# Altium project TB_Controller.PrjPcb
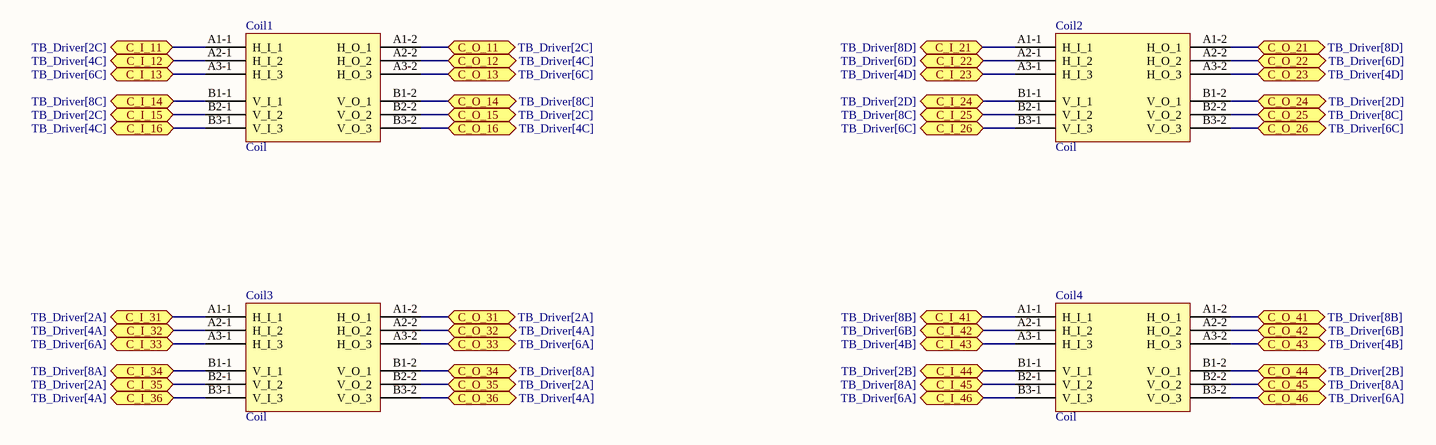
[diagram p0: TB_Piste.SchDoc]
3 sheets, 52 parts. Net scope: flat (ports and power ports of the same name join across sheets).
Board file: TB_PCB.PcbDoc
Sheets:
  TB_Piste.SchDoc
  TB_Driver.SchDoc
  TB_Controller.SchDoc

## Sheet TB_Piste.SchDoc
size A3; SheetNumber: 1; SheetTotal: 3

### Parts
Coil1  Coil  [Bidirectional_Coil]
Coil2  Coil  [Bidirectional_Coil]
Coil3  Coil  [Bidirectional_Coil]
Coil4  Coil  [Bidirectional_Coil]

### Ports
C_I_11 (bidir, see TB_Driver[2C]), C_I_12 (bidir, see TB_Driver[4C]), C_I_13 (bidir, see TB_Driver[6C]), C_I_14 (bidir, see TB_Driver[8C]), C_I_15 (bidir, see TB_Driver[2C]), C_I_16 (bidir, see TB_Driver[4C]), C_I_21 (bidir, see TB_Driver[8D]), C_I_22 (bidir, see TB_Driver[6D]), C_I_23 (bidir, see TB_Driver[4D]), C_I_24 (bidir, see TB_Driver[2D]), C_I_25 (bidir, see TB_Driver[8C]), C_I_26 (bidir, see TB_Driver[6C]), C_I_31 (bidir, see TB_Driver[2A]), C_I_32 (bidir, see TB_Driver[4A]), C_I_33 (bidir, see TB_Driver[6A]), C_I_34 (bidir, see TB_Driver[8A]), C_I_35 (bidir, see TB_Driver[2A]), C_I_36 (bidir, see TB_Driver[4A]), C_I_41 (bidir, see TB_Driver[8B]), C_I_42 (bidir, see TB_Driver[6B]), C_I_43 (bidir, see TB_Driver[4B]), C_I_44 (bidir, see TB_Driver[2B]), C_I_45 (bidir, see TB_Driver[8A]), C_I_46 (bidir, see TB_Driver[6A]), C_O_11 (bidir, see TB_Driver[2C]), C_O_12 (bidir, see TB_Driver[4C]), C_O_13 (bidir, see TB_Driver[6C]), C_O_14 (bidir, see TB_Driver[8C]), C_O_15 (bidir, see TB_Driver[2C]), C_O_16 (bidir, see TB_Driver[4C]), C_O_21 (bidir, see TB_Driver[8D]), C_O_22 (bidir, see TB_Driver[6D]), C_O_23 (bidir, see TB_Driver[4D]), C_O_24 (bidir, see TB_Driver[2D]), C_O_25 (bidir, see TB_Driver[8C]), C_O_26 (bidir, see TB_Driver[6C]), C_O_31 (bidir, see TB_Driver[2A]), C_O_32 (bidir, see TB_Driver[4A]), C_O_33 (bidir, see TB_Driver[6A]), C_O_34 (bidir, see TB_Driver[8A]), C_O_35 (bidir, see TB_Driver[2A]), C_O_36 (bidir, see TB_Driver[4A]), C_O_41 (bidir, see TB_Driver[8B]), C_O_42 (bidir, see TB_Driver[6B]), C_O_43 (bidir, see TB_Driver[4B]), C_O_44 (bidir, see TB_Driver[2B]), C_O_45 (bidir, see TB_Driver[8A]), C_O_46 (bidir, see TB_Driver[6A])

### Nets
NetCoil1_A1-1: Coil1.A1-1(H_I_1) ; port C_I_11
NetCoil1_A1-2: Coil1.A1-2(H_O_1) ; port C_O_11
NetCoil1_A2-1: Coil1.A2-1(H_I_2) ; port C_I_12
NetCoil1_A2-2: Coil1.A2-2(H_O_2) ; port C_O_12
NetCoil1_A3-1: Coil1.A3-1(H_I_3) ; port C_I_13
NetCoil1_A3-2: Coil1.A3-2(H_O_3) ; port C_O_13
NetCoil1_B1-1: Coil1.B1-1(V_I_1) ; port C_I_14
NetCoil1_B1-2: Coil1.B1-2(V_O_1) ; port C_O_14
NetCoil1_B2-1: Coil1.B2-1(V_I_2) ; port C_I_15
NetCoil1_B2-2: Coil1.B2-2(V_O_2) ; port C_O_15
NetCoil1_B3-1: Coil1.B3-1(V_I_3) ; port C_I_16
NetCoil1_B3-2: Coil1.B3-2(V_O_3) ; port C_O_16
NetCoil2_A1-1: Coil2.A1-1(H_I_1) ; port C_I_21
NetCoil2_A1-2: Coil2.A1-2(H_O_1) ; port C_O_21
NetCoil2_A2-1: Coil2.A2-1(H_I_2) ; port C_I_22
NetCoil2_A2-2: Coil2.A2-2(H_O_2) ; port C_O_22
NetCoil2_A3-1: Coil2.A3-1(H_I_3) ; port C_I_23
NetCoil2_A3-2: Coil2.A3-2(H_O_3) ; port C_O_23
NetCoil2_B1-1: Coil2.B1-1(V_I_1) ; port C_I_24
NetCoil2_B1-2: Coil2.B1-2(V_O_1) ; port C_O_24
NetCoil2_B2-1: Coil2.B2-1(V_I_2) ; port C_I_25
NetCoil2_B2-2: Coil2.B2-2(V_O_2) ; port C_O_25
NetCoil2_B3-1: Coil2.B3-1(V_I_3) ; port C_I_26
NetCoil2_B3-2: Coil2.B3-2(V_O_3) ; port C_O_26
NetCoil3_A1-1: Coil3.A1-1(H_I_1) ; port C_I_31
NetCoil3_A1-2: Coil3.A1-2(H_O_1) ; port C_O_31
NetCoil3_A2-1: Coil3.A2-1(H_I_2) ; port C_I_32
NetCoil3_A2-2: Coil3.A2-2(H_O_2) ; port C_O_32
NetCoil3_A3-1: Coil3.A3-1(H_I_3) ; port C_I_33
NetCoil3_A3-2: Coil3.A3-2(H_O_3) ; port C_O_33
NetCoil3_B1-1: Coil3.B1-1(V_I_1) ; port C_I_34
NetCoil3_B1-2: Coil3.B1-2(V_O_1) ; port C_O_34
NetCoil3_B2-1: Coil3.B2-1(V_I_2) ; port C_I_35
NetCoil3_B2-2: Coil3.B2-2(V_O_2) ; port C_O_35
NetCoil3_B3-1: Coil3.B3-1(V_I_3) ; port C_I_36
NetCoil3_B3-2: Coil3.B3-2(V_O_3) ; port C_O_36
NetCoil4_A1-1: Coil4.A1-1(H_I_1) ; port C_I_41
NetCoil4_A1-2: Coil4.A1-2(H_O_1) ; port C_O_41
NetCoil4_A2-1: Coil4.A2-1(H_I_2) ; port C_I_42
NetCoil4_A2-2: Coil4.A2-2(H_O_2) ; port C_O_42
NetCoil4_A3-1: Coil4.A3-1(H_I_3) ; port C_I_43
NetCoil4_A3-2: Coil4.A3-2(H_O_3) ; port C_O_43
NetCoil4_B1-1: Coil4.B1-1(V_I_1) ; port C_I_44
NetCoil4_B1-2: Coil4.B1-2(V_O_1) ; port C_O_44
NetCoil4_B2-1: Coil4.B2-1(V_I_2) ; port C_I_45
NetCoil4_B2-2: Coil4.B2-2(V_O_2) ; port C_O_45
NetCoil4_B3-1: Coil4.B3-1(V_I_3) ; port C_I_46
NetCoil4_B3-2: Coil4.B3-2(V_O_3) ; port C_O_46

## Sheet TB_Driver.SchDoc
size A3; SheetNumber: 2; SheetTotal: 3
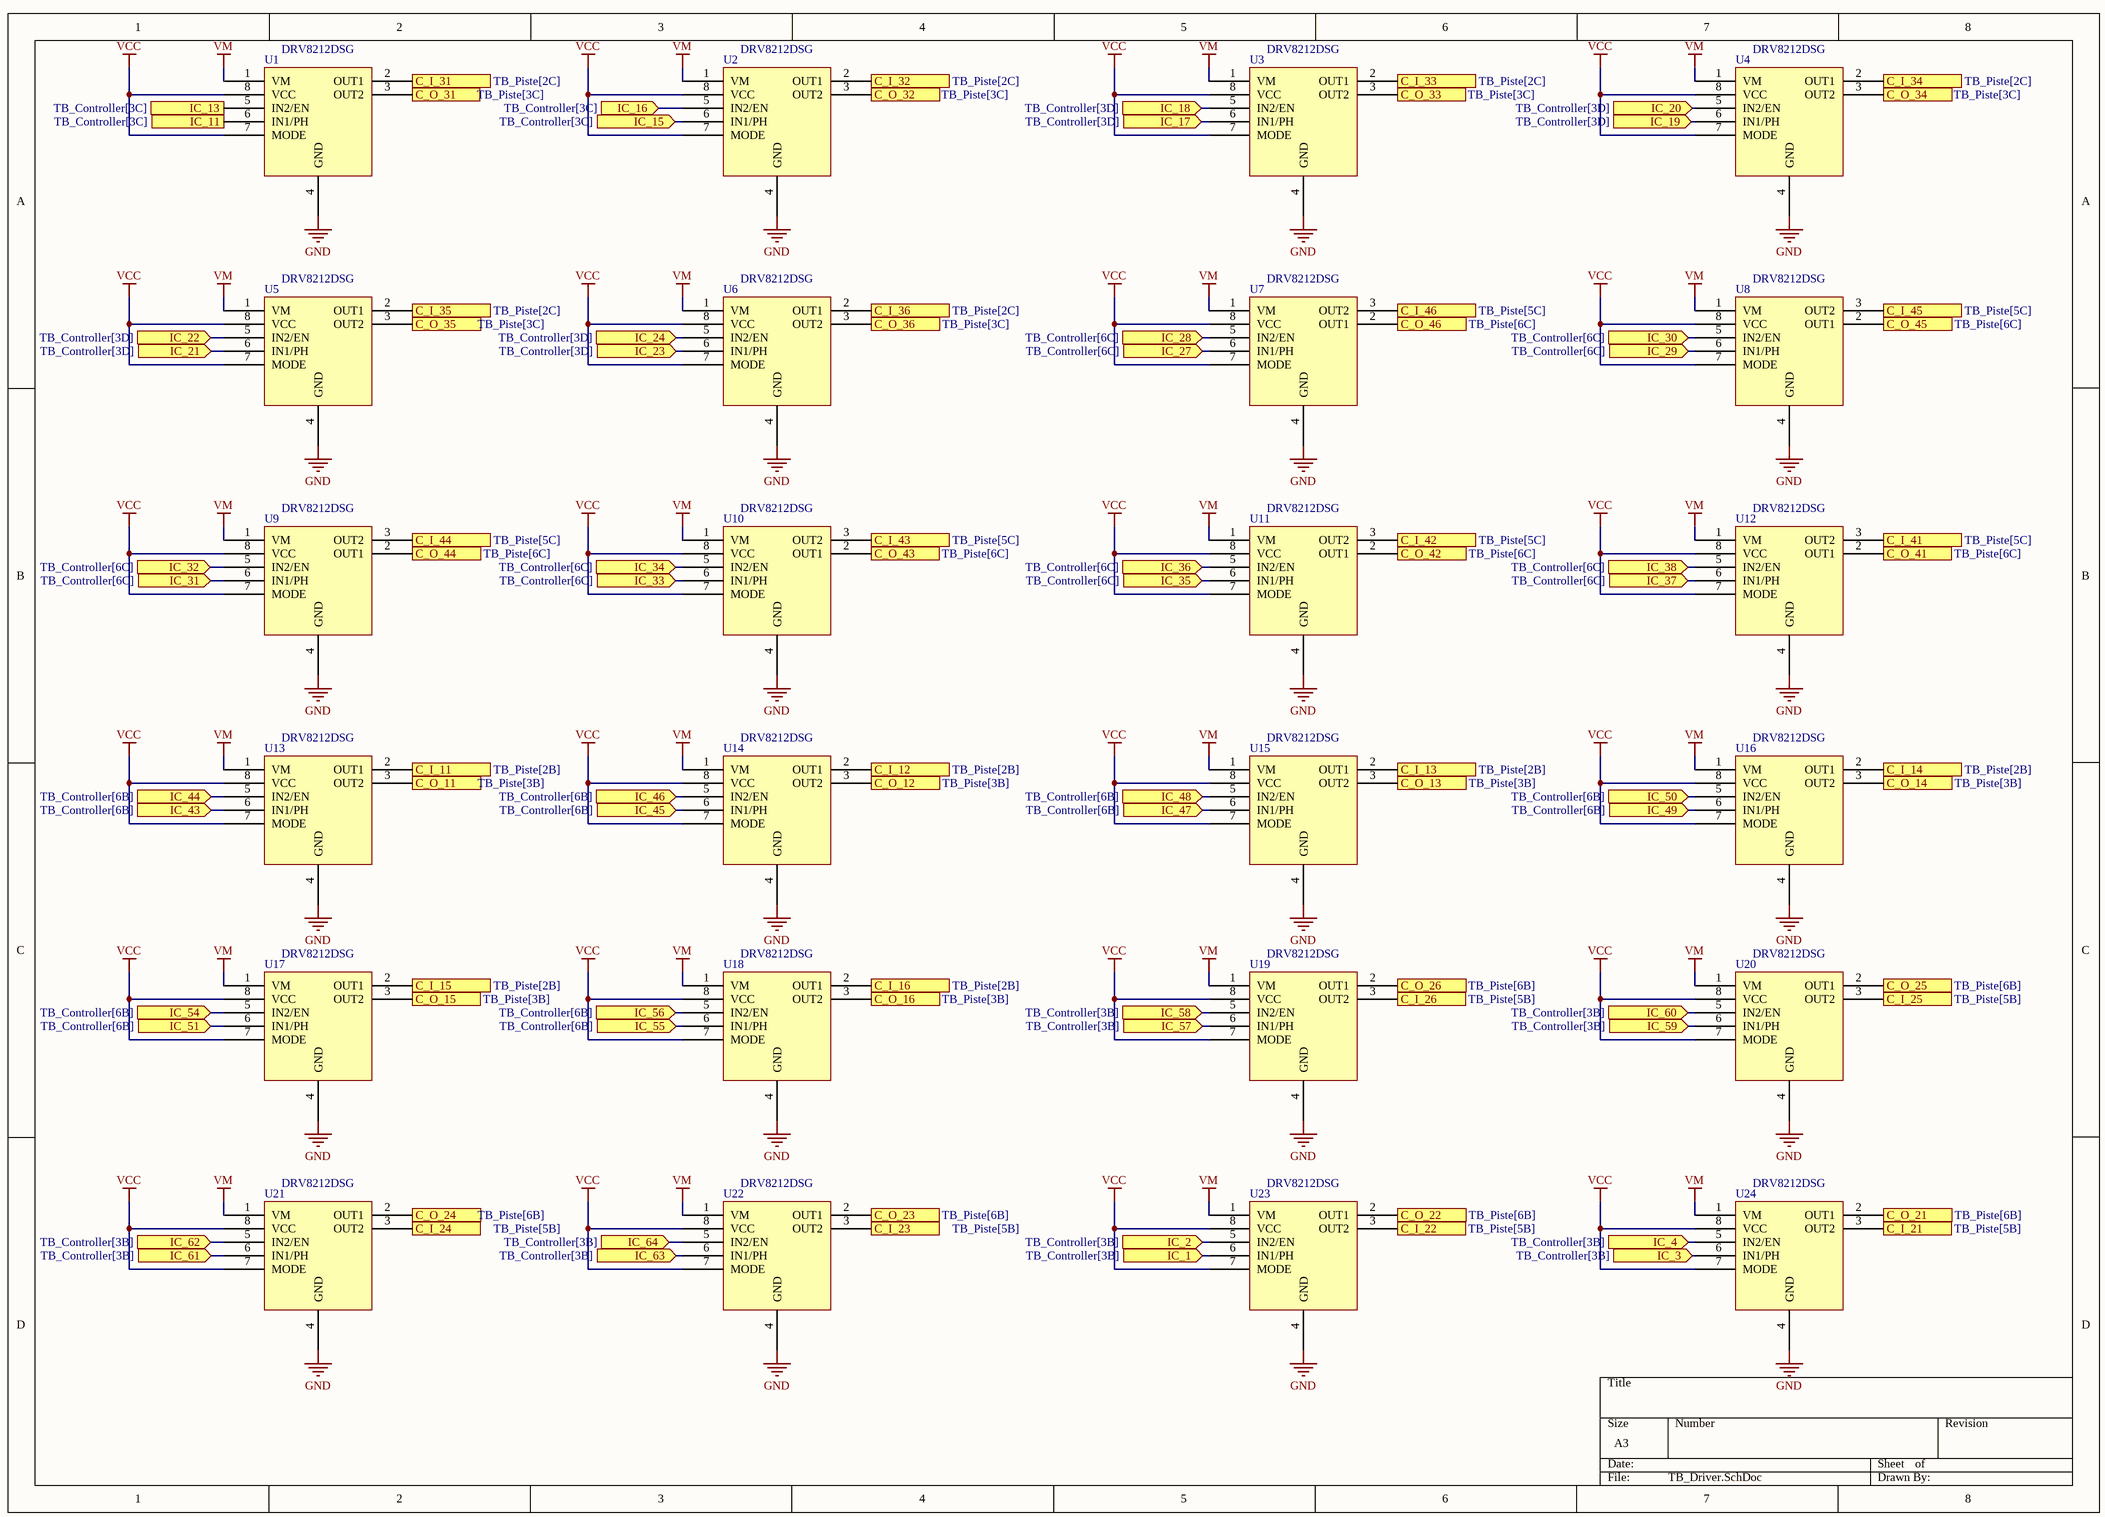
[diagram p1: TB_Driver.SchDoc]

### Parts
U1  DRV8212DSG  [DRV8212DSGR]
U2  DRV8212DSG  [DRV8212DSGR]
U3  DRV8212DSG  [DRV8212DSGR]
U4  DRV8212DSG  [DRV8212DSGR]
U5  DRV8212DSG  [DRV8212DSGR]
U6  DRV8212DSG  [DRV8212DSGR]
U7  DRV8212DSG  [DRV8212DSGR]
U8  DRV8212DSG  [DRV8212DSGR]
U9  DRV8212DSG  [DRV8212DSGR]
U10  DRV8212DSG  [DRV8212DSGR]
U11  DRV8212DSG  [DRV8212DSGR]
U12  DRV8212DSG  [DRV8212DSGR]
U13  DRV8212DSG  [DRV8212DSGR]
U14  DRV8212DSG  [DRV8212DSGR]
U15  DRV8212DSG  [DRV8212DSGR]
U16  DRV8212DSG  [DRV8212DSGR]
U17  DRV8212DSG  [DRV8212DSGR]
U18  DRV8212DSG  [DRV8212DSGR]
U19  DRV8212DSG  [DRV8212DSGR]
U20  DRV8212DSG  [DRV8212DSGR]
U21  DRV8212DSG  [DRV8212DSGR]
U22  DRV8212DSG  [DRV8212DSGR]
U23  DRV8212DSG  [DRV8212DSGR]
U24  DRV8212DSG  [DRV8212DSGR]

### Ports
C_I_11 (see TB_Piste[2B]), C_I_12 (see TB_Piste[2B]), C_I_13 (see TB_Piste[2B]), C_I_14 (see TB_Piste[2B]), C_I_15 (see TB_Piste[2B]), C_I_16 (see TB_Piste[2B]), C_I_21 (see TB_Piste[5B]), C_I_22 (see TB_Piste[5B]), C_I_23 (see TB_Piste[5B]), C_I_24 (see TB_Piste[5B]), C_I_25 (see TB_Piste[5B]), C_I_26 (see TB_Piste[5B]), C_I_31 (see TB_Piste[2C]), C_I_32 (see TB_Piste[2C]), C_I_33 (see TB_Piste[2C]), C_I_34 (see TB_Piste[2C]), C_I_35 (see TB_Piste[2C]), C_I_36 (see TB_Piste[2C]), C_I_41 (see TB_Piste[5C]), C_I_42 (see TB_Piste[5C]), C_I_43 (see TB_Piste[5C]), C_I_44 (see TB_Piste[5C]), C_I_45 (see TB_Piste[5C]), C_I_46 (see TB_Piste[5C]), C_O_11 (see TB_Piste[3B]), C_O_12 (see TB_Piste[3B]), C_O_13 (see TB_Piste[3B]), C_O_14 (see TB_Piste[3B]), C_O_15 (see TB_Piste[3B]), C_O_16 (see TB_Piste[3B]), C_O_21 (see TB_Piste[6B]), C_O_22 (see TB_Piste[6B]), C_O_23 (see TB_Piste[6B]), C_O_24 (see TB_Piste[6B]), C_O_25 (see TB_Piste[6B]), C_O_26 (see TB_Piste[6B]), C_O_31 (see TB_Piste[3C]), C_O_32 (see TB_Piste[3C]), C_O_33 (see TB_Piste[3C]), C_O_34 (see TB_Piste[3C]), C_O_35 (see TB_Piste[3C]), C_O_36 (see TB_Piste[3C]), C_O_41 (see TB_Piste[6C]), C_O_42 (see TB_Piste[6C]), C_O_43 (see TB_Piste[6C]), C_O_44 (see TB_Piste[6C]), C_O_45 (see TB_Piste[6C]), C_O_46 (see TB_Piste[6C]), IC_1 (in, see TB_Controller[3B]), IC_2 (in, see TB_Controller[3B]), IC_3 (in, see TB_Controller[3B]), IC_4 (in, see TB_Controller[3B]), IC_11 (in, see TB_Controller[3C]), IC_13 (in, see TB_Controller[3C]), IC_15 (in, see TB_Controller[3C]), IC_16 (in, see TB_Controller[3C]), IC_17 (in, see TB_Controller[3D]), IC_18 (in, see TB_Controller[3D]), IC_19 (in, see TB_Controller[3D]), IC_20 (in, see TB_Controller[3D]), IC_21 (in, see TB_Controller[3D]), IC_22 (in, see TB_Controller[3D]), IC_23 (in, see TB_Controller[3D]), IC_24 (in, see TB_Controller[3D]), IC_27 (in, see TB_Controller[6C]), IC_28 (in, see TB_Controller[6C]), IC_29 (in, see TB_Controller[6C]), IC_30 (in, see TB_Controller[6C]), IC_31 (in, see TB_Controller[6C]), IC_32 (in, see TB_Controller[6C]), IC_33 (in, see TB_Controller[6C]), IC_34 (in, see TB_Controller[6C]), IC_35 (in, see TB_Controller[6C]), IC_36 (in, see TB_Controller[6C]), IC_37 (in, see TB_Controller[6C]), IC_38 (in, see TB_Controller[6C]), IC_43 (in, see TB_Controller[6B]), IC_44 (in, see TB_Controller[6B]), IC_45 (in, see TB_Controller[6B]), IC_46 (in, see TB_Controller[6B]), IC_47 (in, see TB_Controller[6B]), IC_48 (in, see TB_Controller[6B]), IC_49 (in, see TB_Controller[6B]), IC_50 (in, see TB_Controller[6B]), IC_51 (in, see TB_Controller[6B]), IC_54 (in, see TB_Controller[6B]), IC_55 (in, see TB_Controller[6B]), IC_56 (in, see TB_Controller[6B]), IC_57 (in, see TB_Controller[3B]), IC_58 (in, see TB_Controller[3B]), IC_59 (in, see TB_Controller[3B]), IC_60 (in, see TB_Controller[3B]), IC_61 (in, see TB_Controller[3B]), IC_62 (in, see TB_Controller[3B]), IC_63 (in, see TB_Controller[3B]), IC_64 (in, see TB_Controller[3B])

### Nets
GND: U1.4(GND) U2.4(GND) U3.4(GND) U4.4(GND) U5.4(GND) U6.4(GND) U7.4(GND) U8.4(GND) U9.4(GND) U10.4(GND) U11.4(GND) U12.4(GND) U13.4(GND) U14.4(GND) U15.4(GND) U16.4(GND) U17.4(GND) U18.4(GND) U19.4(GND) U20.4(GND) U21.4(GND) U22.4(GND) U23.4(GND) U24.4(GND)
VCC: U1.7(MODE) U1.8(VCC) U2.7(MODE) U2.8(VCC) U3.7(MODE) U3.8(VCC) U4.7(MODE) U4.8(VCC) U5.7(MODE) U5.8(VCC) U6.7(MODE) U6.8(VCC) U7.7(MODE) U7.8(VCC) U8.7(MODE) U8.8(VCC) U9.7(MODE) U9.8(VCC) U10.7(MODE) U10.8(VCC) U11.7(MODE) U11.8(VCC) U12.7(MODE) U12.8(VCC) U13.7(MODE) U13.8(VCC) U14.7(MODE) U14.8(VCC) U15.7(MODE) U15.8(VCC) U16.7(MODE) U16.8(VCC) U17.7(MODE) U17.8(VCC) U18.7(MODE) U18.8(VCC) U19.7(MODE) U19.8(VCC) U20.7(MODE) U20.8(VCC) U21.7(MODE) U21.8(VCC) U22.7(MODE) U22.8(VCC) U23.7(MODE) U23.8(VCC) U24.7(MODE) U24.8(VCC)
VM: U1.1(VM) U2.1(VM) U3.1(VM) U4.1(VM) U5.1(VM) U6.1(VM) U7.1(VM) U8.1(VM) U9.1(VM) U10.1(VM) U11.1(VM) U12.1(VM) U13.1(VM) U14.1(VM) U15.1(VM) U16.1(VM) U17.1(VM) U18.1(VM) U19.1(VM) U20.1(VM) U21.1(VM) U22.1(VM) U23.1(VM) U24.1(VM)
NetCoil1_A1-1: U13.2(OUT1) ; port C_I_11
NetCoil1_A1-2: U13.3(OUT2) ; port C_O_11
NetCoil1_A2-1: U14.2(OUT1) ; port C_I_12
NetCoil1_A2-2: U14.3(OUT2) ; port C_O_12
NetCoil1_A3-1: U15.2(OUT1) ; port C_I_13
NetCoil1_A3-2: U15.3(OUT2) ; port C_O_13
NetCoil1_B1-1: U16.2(OUT1) ; port C_I_14
NetCoil1_B1-2: U16.3(OUT2) ; port C_O_14
NetCoil1_B2-1: U17.2(OUT1) ; port C_I_15
NetCoil1_B2-2: U17.3(OUT2) ; port C_O_15
NetCoil1_B3-1: U18.2(OUT1) ; port C_I_16
NetCoil1_B3-2: U18.3(OUT2) ; port C_O_16
NetCoil2_A1-1: U24.3(OUT2) ; port C_I_21
NetCoil2_A1-2: U24.2(OUT1) ; port C_O_21
NetCoil2_A2-1: U23.3(OUT2) ; port C_I_22
NetCoil2_A2-2: U23.2(OUT1) ; port C_O_22
NetCoil2_A3-1: U22.3(OUT2) ; port C_I_23
NetCoil2_A3-2: U22.2(OUT1) ; port C_O_23
NetCoil2_B1-1: U21.3(OUT2) ; port C_I_24
NetCoil2_B1-2: U21.2(OUT1) ; port C_O_24
NetCoil2_B2-1: U20.3(OUT2) ; port C_I_25
NetCoil2_B2-2: U20.2(OUT1) ; port C_O_25
NetCoil2_B3-1: U19.3(OUT2) ; port C_I_26
NetCoil2_B3-2: U19.2(OUT1) ; port C_O_26
NetCoil3_A1-1: U1.2(OUT1) ; port C_I_31
NetCoil3_A1-2: U1.3(OUT2) ; port C_O_31
NetCoil3_A2-1: U2.2(OUT1) ; port C_I_32
NetCoil3_A2-2: U2.3(OUT2) ; port C_O_32
NetCoil3_A3-1: U3.2(OUT1) ; port C_I_33
NetCoil3_A3-2: U3.3(OUT2) ; port C_O_33
NetCoil3_B1-1: U4.2(OUT1) ; port C_I_34
NetCoil3_B1-2: U4.3(OUT2) ; port C_O_34
NetCoil3_B2-1: U5.2(OUT1) ; port C_I_35
NetCoil3_B2-2: U5.3(OUT2) ; port C_O_35
NetCoil3_B3-1: U6.2(OUT1) ; port C_I_36
NetCoil3_B3-2: U6.3(OUT2) ; port C_O_36
NetCoil4_A1-1: U12.3(OUT2) ; port C_I_41
NetCoil4_A1-2: U12.2(OUT1) ; port C_O_41
NetCoil4_A2-1: U11.3(OUT2) ; port C_I_42
NetCoil4_A2-2: U11.2(OUT1) ; port C_O_42
NetCoil4_A3-1: U10.3(OUT2) ; port C_I_43
NetCoil4_A3-2: U10.2(OUT1) ; port C_O_43
NetCoil4_B1-1: U9.3(OUT2) ; port C_I_44
NetCoil4_B1-2: U9.2(OUT1) ; port C_O_44
NetCoil4_B2-1: U8.3(OUT2) ; port C_I_45
NetCoil4_B2-2: U8.2(OUT1) ; port C_O_45
NetCoil4_B3-1: U7.3(OUT2) ; port C_I_46
NetCoil4_B3-2: U7.2(OUT1) ; port C_O_46
NetIC1_1: U23.6(IN1/PH) ; port IC_1
NetIC1_2: U23.5(IN2/EN) ; port IC_2
NetIC1_3: U24.6(IN1/PH) ; port IC_3
NetIC1_4: U24.5(IN2/EN) ; port IC_4
NetIC1_11: U1.6(IN1/PH) ; port IC_11
NetIC1_13: U1.5(IN2/EN) ; port IC_13
NetIC1_15: U2.6(IN1/PH) ; port IC_15
NetIC1_16: U2.5(IN2/EN) ; port IC_16
NetIC1_17: U3.6(IN1/PH) ; port IC_17
NetIC1_18: U3.5(IN2/EN) ; port IC_18
NetIC1_19: U4.6(IN1/PH) ; port IC_19
NetIC1_20: U4.5(IN2/EN) ; port IC_20
NetIC1_21: U5.6(IN1/PH) ; port IC_21
NetIC1_22: U5.5(IN2/EN) ; port IC_22
NetIC1_23: U6.6(IN1/PH) ; port IC_23
NetIC1_24: U6.5(IN2/EN) ; port IC_24
NetIC1_27: U7.6(IN1/PH) ; port IC_27
NetIC1_28: U7.5(IN2/EN) ; port IC_28
NetIC1_29: U8.6(IN1/PH) ; port IC_29
NetIC1_30: U8.5(IN2/EN) ; port IC_30
NetIC1_31: U9.6(IN1/PH) ; port IC_31
NetIC1_32: U9.5(IN2/EN) ; port IC_32
NetIC1_33: U10.6(IN1/PH) ; port IC_33
NetIC1_34: U10.5(IN2/EN) ; port IC_34
NetIC1_35: U11.6(IN1/PH) ; port IC_35
NetIC1_36: U11.5(IN2/EN) ; port IC_36
NetIC1_37: U12.6(IN1/PH) ; port IC_37
NetIC1_38: U12.5(IN2/EN) ; port IC_38
NetIC1_43: U13.6(IN1/PH) ; port IC_43
NetIC1_44: U13.5(IN2/EN) ; port IC_44
NetIC1_45: U14.6(IN1/PH) ; port IC_45
NetIC1_46: U14.5(IN2/EN) ; port IC_46
NetIC1_47: U15.6(IN1/PH) ; port IC_47
NetIC1_48: U15.5(IN2/EN) ; port IC_48
NetIC1_49: U16.6(IN1/PH) ; port IC_49
NetIC1_50: U16.5(IN2/EN) ; port IC_50
NetIC1_51: U17.6(IN1/PH) ; port IC_51
NetIC1_54: U17.5(IN2/EN) ; port IC_54
NetIC1_55: U18.6(IN1/PH) ; port IC_55
NetIC1_56: U18.5(IN2/EN) ; port IC_56
NetIC1_57: U19.6(IN1/PH) ; port IC_57
NetIC1_58: U19.5(IN2/EN) ; port IC_58
NetIC1_59: U20.6(IN1/PH) ; port IC_59
NetIC1_60: U20.5(IN2/EN) ; port IC_60
NetIC1_61: U21.6(IN1/PH) ; port IC_61
NetIC1_62: U21.5(IN2/EN) ; port IC_62
NetIC1_63: U22.6(IN1/PH) ; port IC_63
NetIC1_64: U22.5(IN2/EN) ; port IC_64

## Sheet TB_Controller.SchDoc
size A3; SheetNumber: 3; SheetTotal: 3
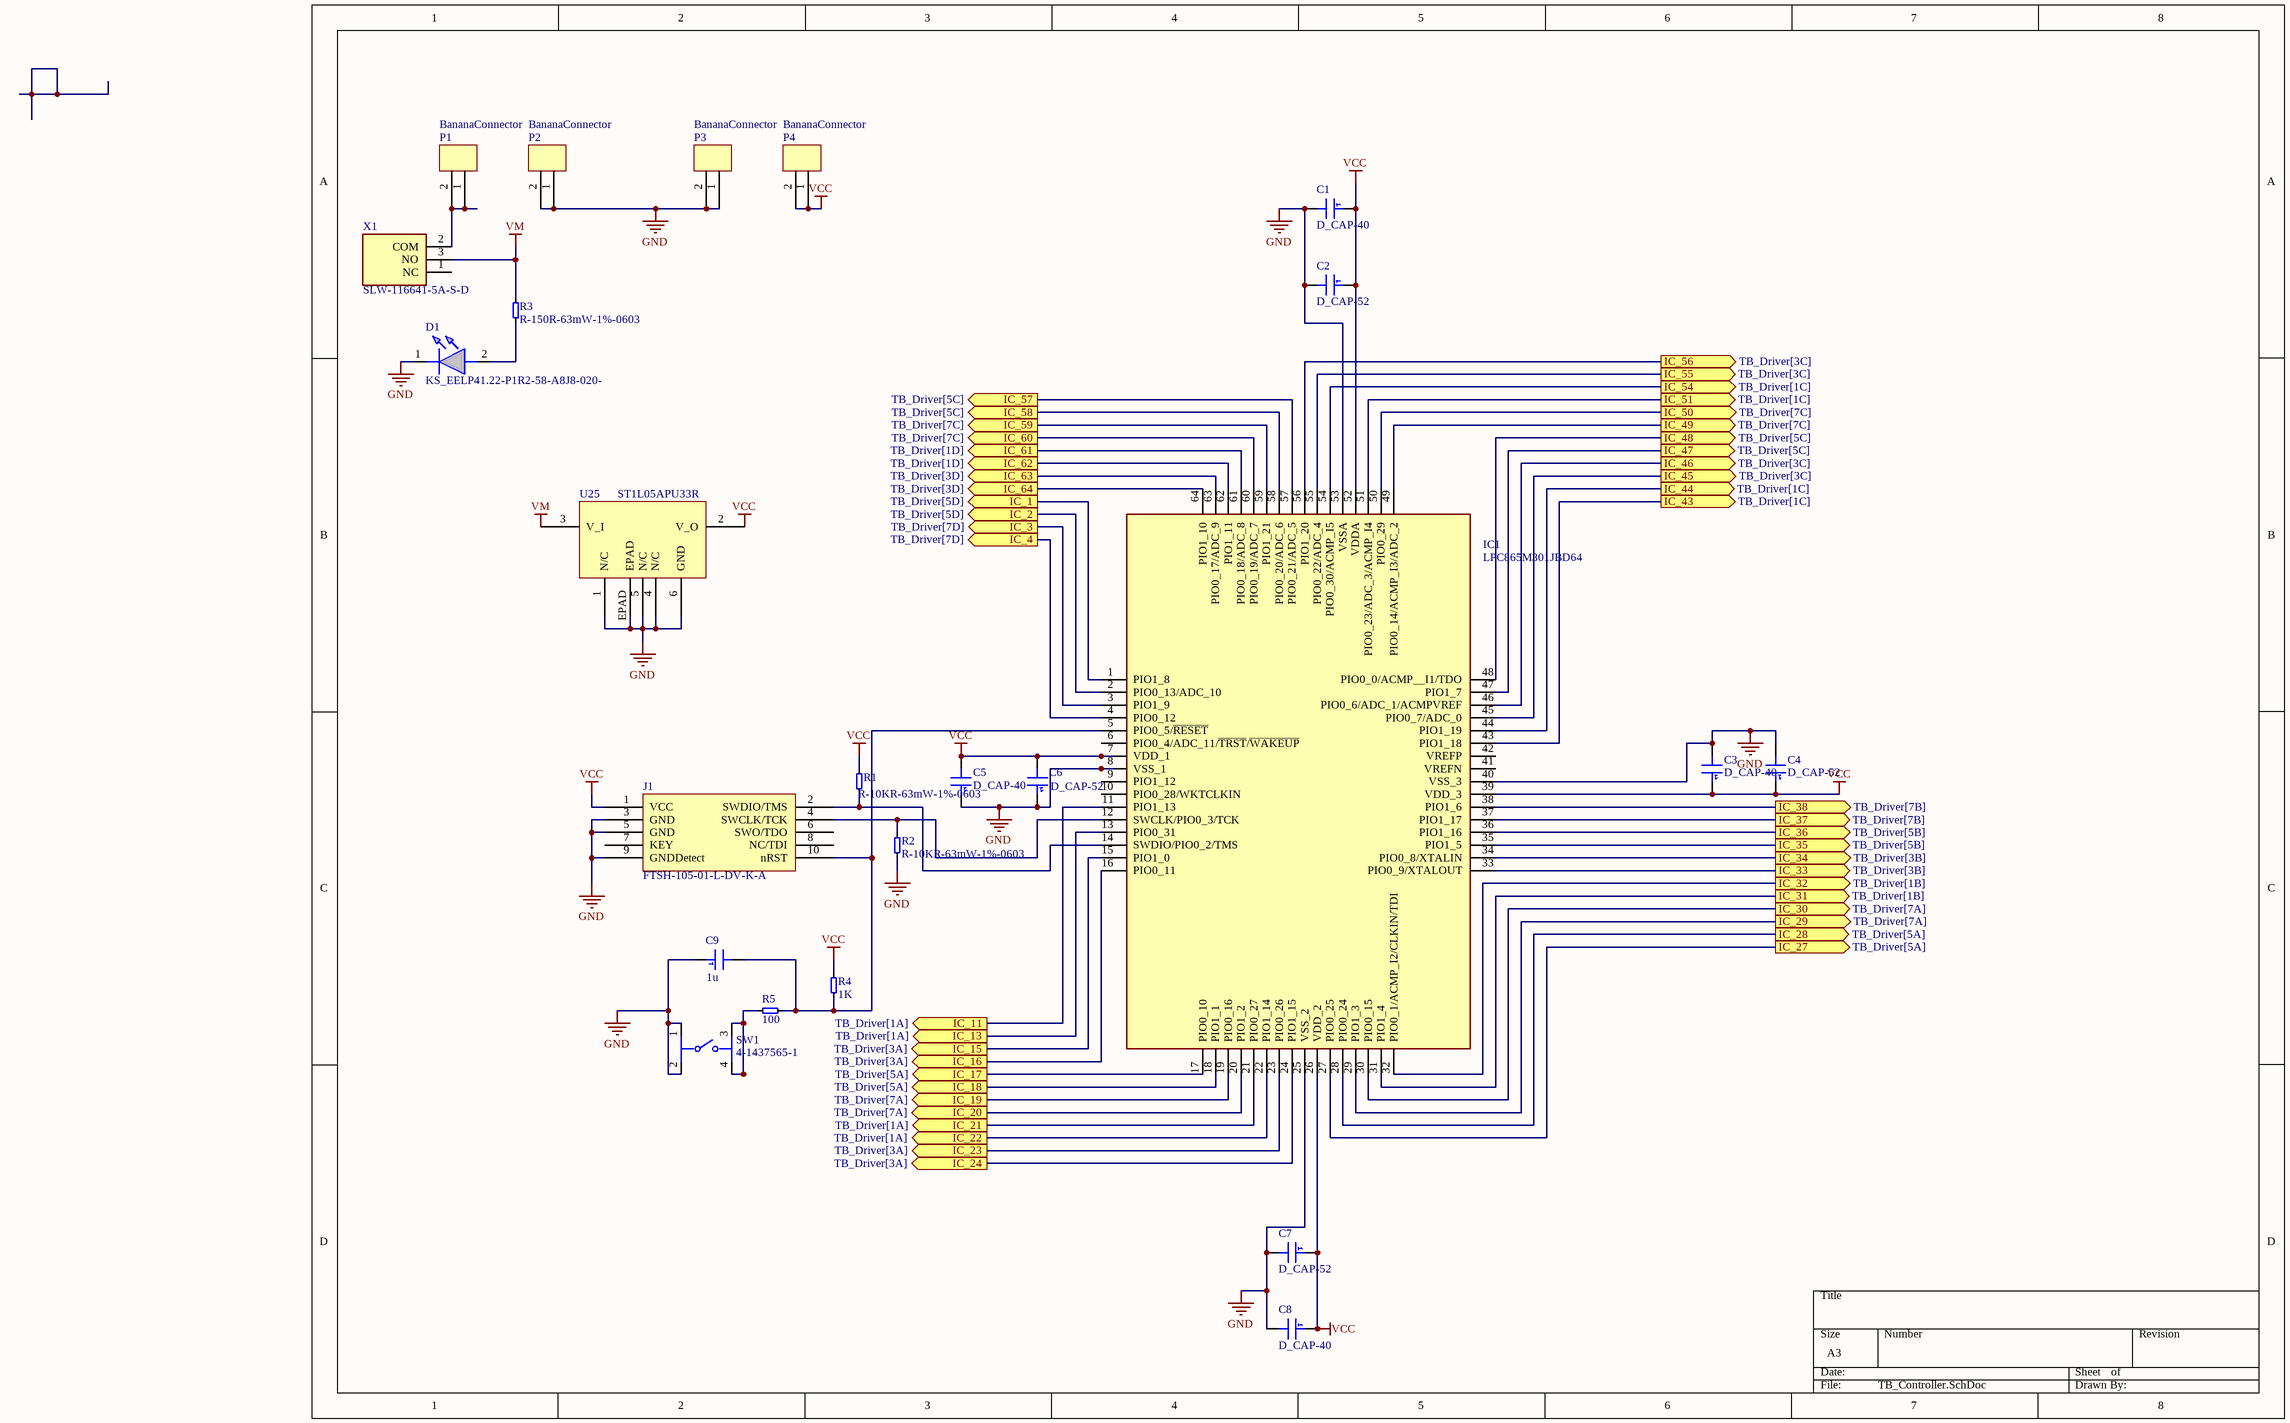
[diagram p2: TB_Controller.SchDoc]

### Parts
C1  D_CAP-40  [CAP_0603H0.8]
C2  D_CAP-52  [CAP_0603H0.8]
C3  D_CAP-40  [CAP_0603H0.8]
C4  D_CAP-52  [CAP_0603H0.8]
C5  D_CAP-40  [CAP_0603H0.8]
C6  D_CAP-52  [CAP_0603H0.8]
C7  D_CAP-52  [CAP_0603H0.8]
C8  D_CAP-40  [CAP_0603H0.8]
C9  1u  [CAP_0603H0.8]
D1  KS_EELP41.22-P1R2-58-A8J8-020-  [KSEELP4122P1R258A8J8020R18]
IC1  LPC865M301JBD64  [LPC865M301JBD64]
J1  FTSH-105-01-L-DV-K-A  [FTSH-105-01-L-DV-K-A]
P1  BananaConnector  [Delton Banana Plug 500 Red]
P2  BananaConnector  [Delton Banana Plug 100 Black]
P3  BananaConnector  [Delton Banana Plug 100 Black]
P4  BananaConnector  [Delton Banana Plug 500 Red]
R1  R-10KR-63mW-1%-0603  [T_RESC0603X30N]
R2  R-10KR-63mW-1%-0603  [T_RESC0603X30N]
R3  R-150R-63mW-1%-0603  [T_RESC0603X30N]
R4  1K  [T_RESC0603X30N]
R5  100  [T_RESC0603X30N]
SW1  4-1437565-1  [FP-4-1437565-1-MFG]
U25  ST1L05APU33R  [ST1L05APU33R]
X1  SLW-116641-5A-S-D  [SLW-116641-5A-S-D]

### Ports
IC_1 (out, see TB_Driver[5D]), IC_2 (out, see TB_Driver[5D]), IC_3 (out, see TB_Driver[7D]), IC_4 (out, see TB_Driver[7D]), IC_11 (out, see TB_Driver[1A]), IC_13 (out, see TB_Driver[1A]), IC_15 (out, see TB_Driver[3A]), IC_16 (out, see TB_Driver[3A]), IC_17 (out, see TB_Driver[5A]), IC_18 (out, see TB_Driver[5A]), IC_19 (out, see TB_Driver[7A]), IC_20 (out, see TB_Driver[7A]), IC_21 (out, see TB_Driver[1A]), IC_22 (out, see TB_Driver[1A]), IC_23 (out, see TB_Driver[3A]), IC_24 (out, see TB_Driver[3A]), IC_27 (out, see TB_Driver[5A]), IC_28 (out, see TB_Driver[5A]), IC_29 (out, see TB_Driver[7A]), IC_30 (out, see TB_Driver[7A]), IC_31 (out, see TB_Driver[1B]), IC_32 (out, see TB_Driver[1B]), IC_33 (out, see TB_Driver[3B]), IC_34 (out, see TB_Driver[3B]), IC_35 (out, see TB_Driver[5B]), IC_36 (out, see TB_Driver[5B]), IC_37 (out, see TB_Driver[7B]), IC_38 (out, see TB_Driver[7B]), IC_43 (out, see TB_Driver[1C]), IC_44 (out, see TB_Driver[1C]), IC_45 (out, see TB_Driver[3C]), IC_46 (out, see TB_Driver[3C]), IC_47 (out, see TB_Driver[5C]), IC_48 (out, see TB_Driver[5C]), IC_49 (out, see TB_Driver[7C]), IC_50 (out, see TB_Driver[7C]), IC_51 (out, see TB_Driver[1C]), IC_54 (out, see TB_Driver[1C]), IC_55 (out, see TB_Driver[3C]), IC_56 (out, see TB_Driver[3C]), IC_57 (out, see TB_Driver[5C]), IC_58 (out, see TB_Driver[5C]), IC_59 (out, see TB_Driver[7C]), IC_60 (out, see TB_Driver[7C]), IC_61 (out, see TB_Driver[1D]), IC_62 (out, see TB_Driver[1D]), IC_63 (out, see TB_Driver[3D]), IC_64 (out, see TB_Driver[3D])

### Nets
GND: C1.2 C2.2 C3.2 C4.2 C5.1 C6.1 C7.2 C8.2 C9.1 D1.1(K) IC1.8(VSS_1) IC1.25(VSS_2) IC1.40(VSS_3) IC1.53(VSSA) J1.3(GND) J1.5(GND) J1.9(GNDDetect) P2.1 P2.2 P3.1 P3.2 R2.1 SW1.1 SW1.2 U25.1(N/C) U25.4(N/C) U25.5(N/C) U25.6(GND) U25.EPAD
VCC: C1.1 C2.1 C3.1 C4.1 C5.2 C6.2 C7.1 C8.1 IC1.7(VDD_1) IC1.26(VDD_2) IC1.39(VDD_3) IC1.52(VDDA) J1.1(VCC) P4.1 P4.2 R1.2 R4.2 U25.2(V_O)
VM: R3.2 U25.3(V_I) X1.3(NO)
NetC9_2: C9.2 IC1.5(PIO0_5/~{RESET}) J1.10(nRST) R4.1 R5.2
NetD1_2: D1.2(A) R3.1
NetIC1_1: IC1.1(PIO1_8) ; port IC_1
NetIC1_2: IC1.2(PIO0_13/ADC_10) ; port IC_2
NetIC1_3: IC1.3(PIO1_9) ; port IC_3
NetIC1_4: IC1.4(PIO0_12) ; port IC_4
NetIC1_11: IC1.11(PIO1_13) ; port IC_11
NetIC1_12: IC1.12(SWCLK/PIO0_3/TCK) J1.4(SWCLK/TCK) R2.2
NetIC1_13: IC1.13(PIO0_31) ; port IC_13
NetIC1_14: IC1.14(SWDIO/PIO0_2/TMS) J1.2(SWDIO/TMS) R1.1
NetIC1_15: IC1.15(PIO1_0) ; port IC_15
NetIC1_16: IC1.16(PIO0_11) ; port IC_16
NetIC1_17: IC1.17(PIO0_10) ; port IC_17
NetIC1_18: IC1.18(PIO1_1) ; port IC_18
NetIC1_19: IC1.19(PIO0_16) ; port IC_19
NetIC1_20: IC1.20(PIO1_2) ; port IC_20
NetIC1_21: IC1.21(PIO0_27) ; port IC_21
NetIC1_22: IC1.22(PIO1_14) ; port IC_22
NetIC1_23: IC1.23(PIO0_26) ; port IC_23
NetIC1_24: IC1.24(PIO1_15) ; port IC_24
NetIC1_27: IC1.27(PIO0_25) ; port IC_27
NetIC1_28: IC1.28(PIO0_24) ; port IC_28
NetIC1_29: IC1.29(PIO1_3) ; port IC_29
NetIC1_30: IC1.30(PIO0_15) ; port IC_30
NetIC1_31: IC1.31(PIO1_4) ; port IC_31
NetIC1_32: IC1.32(PIO0_1/ACMP_I2/CLKIN/TDI) ; port IC_32
NetIC1_33: IC1.33(PIO0_9/XTALOUT) ; port IC_33
NetIC1_34: IC1.34(PIO0_8/XTALIN) ; port IC_34
NetIC1_35: IC1.35(PIO1_5) ; port IC_35
NetIC1_36: IC1.36(PIO1_16) ; port IC_36
NetIC1_37: IC1.37(PIO1_17) ; port IC_37
NetIC1_38: IC1.38(PIO1_6) ; port IC_38
NetIC1_43: IC1.43(PIO1_18) ; port IC_43
NetIC1_44: IC1.44(PIO1_19) ; port IC_44
NetIC1_45: IC1.45(PIO0_7/ADC_0) ; port IC_45
NetIC1_46: IC1.46(PIO0_6/ADC_1/ACMPVREF) ; port IC_46
NetIC1_47: IC1.47(PIO1_7) ; port IC_47
NetIC1_48: IC1.48(PIO0_0/ACMP__I1/TDO) ; port IC_48
NetIC1_49: IC1.49(PIO0_14/ACMP_I3/ADC_2) ; port IC_49
NetIC1_50: IC1.50(PIO0_29) ; port IC_50
NetIC1_51: IC1.51(PIO0_23/ADC_3/ACMP_I4) ; port IC_51
NetIC1_54: IC1.54(PIO0_30/ACMP_I5) ; port IC_54
NetIC1_55: IC1.55(PIO0_22/ADC_4) ; port IC_55
NetIC1_56: IC1.56(PIO1_20) ; port IC_56
NetIC1_57: IC1.57(PIO0_21/ADC_5) ; port IC_57
NetIC1_58: IC1.58(PIO0_20/ADC_6) ; port IC_58
NetIC1_59: IC1.59(PIO1_21) ; port IC_59
NetIC1_60: IC1.60(PIO0_19/ADC_7) ; port IC_60
NetIC1_61: IC1.61(PIO0_18/ADC_8) ; port IC_61
NetIC1_62: IC1.62(PIO1_11) ; port IC_62
NetIC1_63: IC1.63(PIO0_17/ADC_9) ; port IC_63
NetIC1_64: IC1.64(PIO1_10) ; port IC_64
NetP1_1: P1.1 P1.2 X1.2(COM)
NetR5_1: R5.1 SW1.3 SW1.4

Not connected (* = marked no-connect by the designer): IC1 6(PIO0_4/ADC_11/~{TRST}/~{WAKEUP}) 9(PIO1_12) 10(PIO0_28/WKTCLKIN) 41(VREFN) 42(VREFP); J1 6(SWO/TDO) 7(KEY) 8(NC/TDI); X1 1(NC)

### Library data of the parts
C1 C3 C5 C8 = CMP-066-000039-1: Boite Labo 0603: Ceramic Cap, 10nF, 5%, 50V, CAP_0603H0.8; Manufacturer: Murata; ManufacturerPN: GRM1885C1H103JA01D; Tol (%): 5; UnitaryCost: 0; Pol: NO; Designer: R.Mastrocola; Footprint Category: SM_CHIP; DCVoltage (V): 50V; Value: 10nF; HelpURL: http://www.findchips.com/search/GRM1885C1H103JA01D; Type: Ceramic; Supplier1: Mouser; Supplier1PN: 81-GRM1885C1H103JA1D; Projet: Labo; Supplier2PN: -; LatestRevisionDate: 19.02.2015; Part Number: D_CAP-40; Supplier2: -
C2 C4 C6 C7 = CMP-066-000051-1: Boite Labo 0603: Ceramic Cap, 100nF, 10%, 50V, CAP_0603H0.8; Manufacturer: Murata; ManufacturerPN: GCM188L81H104KA57D; F27: Osolète; UnitaryCost: 0.176; Tol (%): 10; Designer: R.Mastrocola; F28: GRM188L81H104KA93D; Pol: NO; Footprint Category: SM_CHIP; Supplier2: -; Supplier1: Mouser; Value: 100nF; DCVoltage (V): 50V; Projet: Labo; LatestRevisionDate: 15.01.2020; Part Number: D_CAP-52; Type: Ceramic; Supplier1PN: 81-GCM188L81H104KA7D; HelpURL: http://www.findchips.com/search/GCM188L81H104KA57D
C9 = CMP-066-000063-1: Boite Labo 0603: Ceramic Cap, 1uF, 10%, 50V, CAP_0603H0.8; ManufacturerPN: GRM188R61H105KAALD; Part Number: D_CAP-64; Manufacturer: Murata; Pol: NO; UnitaryCost: 0.16; Designer: R.Mastrocola; Tol (%): 10; Projet: Labo; Supplier1: Mouser; Supplier1PN: CL10A105KB8NNNC; Value: 1uF; Footprint Category: SM_CHIP; Supplier2PN: 1276-1860-1-ND; DCVoltage (V): 50V; HelpURL: http://www.findchips.com/search/GRM188R61H105KAALD; LatestRevisionDate: 19.02.2015; Type: Ceramic; Supplier2: Digi-Key
D1 = KS_EELP41.22-P1R2-58-A8J8-020-: Standard LEDs - SMD 0603 (1608 metric); Manufacturer_Name: ams OSRAM; Manufacturer_Part_Number: KS EELP41.22-P1R2-58-A8J8-020-R18; Geometry.Height: 0.5mm; Mouser Part Number: 720-P412P1R258A8J802; Mouser Price/Stock: https://www.mouser.co.uk/ProductDetail/ams-OSRAM/KS-EELP41.22-P1R2-58-A8J8-020-R18?qs=ZcfC38r4Povp3XTr6Zxf%252Bw%3D%3D; Datasheet Link: https://www.digikey.ph/en/products/detail/ams-osram-usa-inc/KS-EELP41-22-P1R2-58-A8J8-020-R18/24765247
R1 R2 = CMP-003-0498-1: Resistor 10 Kohm 63mW 1% 0603; Value: 10KR; Component Name: R-10KR-63mW-1%-0603; Rating: 63mW; Source: Ixora.SchLib; Tolerance: 1%
R3 = CMP-003-0154-1: Resistor 150 ohm 63mW 1% 0603; Value: 150R; Tolerance: 1%; Source: Ixora.SchLib; Component Name: R-150R-63mW-1%-0603; Rating: 63mW
R4 = CMP-003-0419-1: Resistor 1 Kohm 63mW 5% 0603; Component Name: R-1KR-63mW-5%-0603; Rating: 63mW; Tolerance: 5%; Source: Ixora.SchLib; Value: 1K
R5 = CMP-003-0496-1: Resistor 100 ohm 63mW 5% 0603; Component Name: R-100R-63mW-5%-0603; Value: 100R; Tolerance: 5%; Source: Ixora.SchLib; Rating: 63mW
SW1 = CMP-03407-000003-1: SWITCH TACTILE SPST-NO 0.05A 24V; Manufacturer: TE Connectivity; Ciiva Ids: 2672442; Contact Current Rating: 50mA; Operating Force: 160gf; Contact Resistance: 100mΩ; Electromechanical Life: 100000Cycles; Standoff Height: 0.05mm; Import Ts: 1521848451; Category: Switch; ComponentLink2Description: Datasheet; Mount: Surface Mount; Digikey Description: SWITCH TACTILE SPST-NO 0.05A 24V; Device Class L3: Tactile Switches; Release Date: 1503379960; Octopart: https://octopart.com/fsm4jsma-te+connectivity-55488004; Temperature Range Low: -35°C; Lead Free: Yes; RoHS: TRUE; Mouser Description: Switch Tactile OFF (ON) SPST Round Button Gull Wing 0.05A 12VDC 1.57N SMD Loose Piece; Voltage Rating Dc: 24V; ComponentLink2URL: https://www.te.com/commerce/DocumentDelivery/DDEController?Action=showdoc&DocId=Customer+Drawing%7F2-1437565-7%7FV%7Fpdf%7FEnglish%7FENG_CD_2-1437565-7_V.pdf%7F4-1437565-1; Height: 5.38mm; Package: 0; Temperature Range High: +85°C; Device Class L2: Switches; Manufacturer Part Number: 4-1437565-1; Temperature: -35°C to +85°C; Device Class L1: Electromechanical; Automotive: No; Throw Configuration: SPST-NO
U25 = ST1L05APU33R: DFN6 (3x3 mm) Input -0.3 to 7V and output 3.3V at max 1.3A
X1 = SLW-116641-5A-S-D: 11.6 x 6 x 4.1 mm, 5 mm Raised Slide Actuator, Through Hole, Slide Switch

## Nets that join several sheets
GND: TB_Driver (24 pins), TB_Controller (29 pins)
VCC: TB_Driver (48 pins), TB_Controller (18 pins)
VM: TB_Driver (24 pins), TB_Controller (R3.2 U25.3 X1.3)
NetCoil1_A1-1: TB_Piste (Coil1.A1-1), TB_Driver (U13.2)
NetCoil1_A1-2: TB_Piste (Coil1.A1-2), TB_Driver (U13.3)
NetCoil1_A2-1: TB_Piste (Coil1.A2-1), TB_Driver (U14.2)
NetCoil1_A2-2: TB_Piste (Coil1.A2-2), TB_Driver (U14.3)
NetCoil1_A3-1: TB_Piste (Coil1.A3-1), TB_Driver (U15.2)
NetCoil1_A3-2: TB_Piste (Coil1.A3-2), TB_Driver (U15.3)
NetCoil1_B1-1: TB_Piste (Coil1.B1-1), TB_Driver (U16.2)
NetCoil1_B1-2: TB_Piste (Coil1.B1-2), TB_Driver (U16.3)
NetCoil1_B2-1: TB_Piste (Coil1.B2-1), TB_Driver (U17.2)
NetCoil1_B2-2: TB_Piste (Coil1.B2-2), TB_Driver (U17.3)
NetCoil1_B3-1: TB_Piste (Coil1.B3-1), TB_Driver (U18.2)
NetCoil1_B3-2: TB_Piste (Coil1.B3-2), TB_Driver (U18.3)
NetCoil2_A1-1: TB_Piste (Coil2.A1-1), TB_Driver (U24.3)
NetCoil2_A1-2: TB_Piste (Coil2.A1-2), TB_Driver (U24.2)
NetCoil2_A2-1: TB_Piste (Coil2.A2-1), TB_Driver (U23.3)
NetCoil2_A2-2: TB_Piste (Coil2.A2-2), TB_Driver (U23.2)
NetCoil2_A3-1: TB_Piste (Coil2.A3-1), TB_Driver (U22.3)
NetCoil2_A3-2: TB_Piste (Coil2.A3-2), TB_Driver (U22.2)
NetCoil2_B1-1: TB_Piste (Coil2.B1-1), TB_Driver (U21.3)
NetCoil2_B1-2: TB_Piste (Coil2.B1-2), TB_Driver (U21.2)
NetCoil2_B2-1: TB_Piste (Coil2.B2-1), TB_Driver (U20.3)
NetCoil2_B2-2: TB_Piste (Coil2.B2-2), TB_Driver (U20.2)
NetCoil2_B3-1: TB_Piste (Coil2.B3-1), TB_Driver (U19.3)
NetCoil2_B3-2: TB_Piste (Coil2.B3-2), TB_Driver (U19.2)
NetCoil3_A1-1: TB_Piste (Coil3.A1-1), TB_Driver (U1.2)
NetCoil3_A1-2: TB_Piste (Coil3.A1-2), TB_Driver (U1.3)
NetCoil3_A2-1: TB_Piste (Coil3.A2-1), TB_Driver (U2.2)
NetCoil3_A2-2: TB_Piste (Coil3.A2-2), TB_Driver (U2.3)
NetCoil3_A3-1: TB_Piste (Coil3.A3-1), TB_Driver (U3.2)
NetCoil3_A3-2: TB_Piste (Coil3.A3-2), TB_Driver (U3.3)
NetCoil3_B1-1: TB_Piste (Coil3.B1-1), TB_Driver (U4.2)
NetCoil3_B1-2: TB_Piste (Coil3.B1-2), TB_Driver (U4.3)
NetCoil3_B2-1: TB_Piste (Coil3.B2-1), TB_Driver (U5.2)
NetCoil3_B2-2: TB_Piste (Coil3.B2-2), TB_Driver (U5.3)
NetCoil3_B3-1: TB_Piste (Coil3.B3-1), TB_Driver (U6.2)
NetCoil3_B3-2: TB_Piste (Coil3.B3-2), TB_Driver (U6.3)
NetCoil4_A1-1: TB_Piste (Coil4.A1-1), TB_Driver (U12.3)
NetCoil4_A1-2: TB_Piste (Coil4.A1-2), TB_Driver (U12.2)
NetCoil4_A2-1: TB_Piste (Coil4.A2-1), TB_Driver (U11.3)
NetCoil4_A2-2: TB_Piste (Coil4.A2-2), TB_Driver (U11.2)
NetCoil4_A3-1: TB_Piste (Coil4.A3-1), TB_Driver (U10.3)
NetCoil4_A3-2: TB_Piste (Coil4.A3-2), TB_Driver (U10.2)
NetCoil4_B1-1: TB_Piste (Coil4.B1-1), TB_Driver (U9.3)
NetCoil4_B1-2: TB_Piste (Coil4.B1-2), TB_Driver (U9.2)
NetCoil4_B2-1: TB_Piste (Coil4.B2-1), TB_Driver (U8.3)
NetCoil4_B2-2: TB_Piste (Coil4.B2-2), TB_Driver (U8.2)
NetCoil4_B3-1: TB_Piste (Coil4.B3-1), TB_Driver (U7.3)
NetCoil4_B3-2: TB_Piste (Coil4.B3-2), TB_Driver (U7.2)
NetIC1_1: TB_Driver (U23.6), TB_Controller (IC1.1)
NetIC1_2: TB_Driver (U23.5), TB_Controller (IC1.2)
NetIC1_3: TB_Driver (U24.6), TB_Controller (IC1.3)
NetIC1_4: TB_Driver (U24.5), TB_Controller (IC1.4)
NetIC1_11: TB_Driver (U1.6), TB_Controller (IC1.11)
NetIC1_13: TB_Driver (U1.5), TB_Controller (IC1.13)
NetIC1_15: TB_Driver (U2.6), TB_Controller (IC1.15)
NetIC1_16: TB_Driver (U2.5), TB_Controller (IC1.16)
NetIC1_17: TB_Driver (U3.6), TB_Controller (IC1.17)
NetIC1_18: TB_Driver (U3.5), TB_Controller (IC1.18)
NetIC1_19: TB_Driver (U4.6), TB_Controller (IC1.19)
NetIC1_20: TB_Driver (U4.5), TB_Controller (IC1.20)
NetIC1_21: TB_Driver (U5.6), TB_Controller (IC1.21)
NetIC1_22: TB_Driver (U5.5), TB_Controller (IC1.22)
NetIC1_23: TB_Driver (U6.6), TB_Controller (IC1.23)
NetIC1_24: TB_Driver (U6.5), TB_Controller (IC1.24)
NetIC1_27: TB_Driver (U7.6), TB_Controller (IC1.27)
NetIC1_28: TB_Driver (U7.5), TB_Controller (IC1.28)
NetIC1_29: TB_Driver (U8.6), TB_Controller (IC1.29)
NetIC1_30: TB_Driver (U8.5), TB_Controller (IC1.30)
NetIC1_31: TB_Driver (U9.6), TB_Controller (IC1.31)
NetIC1_32: TB_Driver (U9.5), TB_Controller (IC1.32)
NetIC1_33: TB_Driver (U10.6), TB_Controller (IC1.33)
NetIC1_34: TB_Driver (U10.5), TB_Controller (IC1.34)
NetIC1_35: TB_Driver (U11.6), TB_Controller (IC1.35)
NetIC1_36: TB_Driver (U11.5), TB_Controller (IC1.36)
NetIC1_37: TB_Driver (U12.6), TB_Controller (IC1.37)
NetIC1_38: TB_Driver (U12.5), TB_Controller (IC1.38)
NetIC1_43: TB_Driver (U13.6), TB_Controller (IC1.43)
NetIC1_44: TB_Driver (U13.5), TB_Controller (IC1.44)
NetIC1_45: TB_Driver (U14.6), TB_Controller (IC1.45)
NetIC1_46: TB_Driver (U14.5), TB_Controller (IC1.46)
NetIC1_47: TB_Driver (U15.6), TB_Controller (IC1.47)
NetIC1_48: TB_Driver (U15.5), TB_Controller (IC1.48)
NetIC1_49: TB_Driver (U16.6), TB_Controller (IC1.49)
NetIC1_50: TB_Driver (U16.5), TB_Controller (IC1.50)
NetIC1_51: TB_Driver (U17.6), TB_Controller (IC1.51)
NetIC1_54: TB_Driver (U17.5), TB_Controller (IC1.54)
NetIC1_55: TB_Driver (U18.6), TB_Controller (IC1.55)
NetIC1_56: TB_Driver (U18.5), TB_Controller (IC1.56)
NetIC1_57: TB_Driver (U19.6), TB_Controller (IC1.57)
NetIC1_58: TB_Driver (U19.5), TB_Controller (IC1.58)
NetIC1_59: TB_Driver (U20.6), TB_Controller (IC1.59)
NetIC1_60: TB_Driver (U20.5), TB_Controller (IC1.60)
NetIC1_61: TB_Driver (U21.6), TB_Controller (IC1.61)
NetIC1_62: TB_Driver (U21.5), TB_Controller (IC1.62)
NetIC1_63: TB_Driver (U22.6), TB_Controller (IC1.63)
NetIC1_64: TB_Driver (U22.5), TB_Controller (IC1.64)